# EAGLE design The C64 Big T Switcher FITTEST (EAGLE 9.6.1)
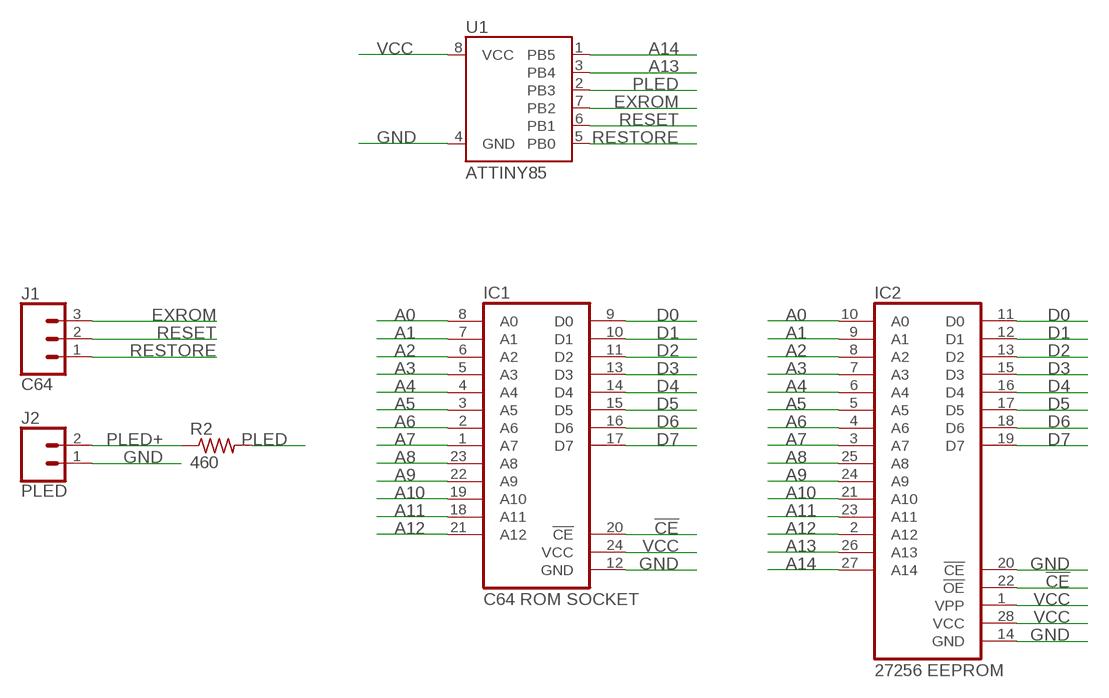
[diagram p0: schematic, sheet 1]

## Parts
IC1  C64 ROM SOCKET  2364  [DIL24]
IC2  27256 EEPROM  27256  [DIL28]
J1  C64  CONN_03  [1X03]
J2  PLED  CONN_02  [1X02]
R2  460  R-US_0207/10  [0207/10]
U1  ATTINY85  [ATTINY85]

## Nets
!CE: IC1.20(!CE) IC2.22(!OE)
A0: IC1.8(A0) IC2.10(A0)
A1: IC1.7(A1) IC2.9(A1)
A2: IC1.6(A2) IC2.8(A2)
A3: IC1.5(A3) IC2.7(A3)
A4: IC1.4(A4) IC2.6(A4)
A5: IC1.3(A5) IC2.5(A5)
A6: IC1.2(A6) IC2.4(A6)
A7: IC1.1(A7) IC2.3(A7)
A8: IC1.23(A8) IC2.25(A8)
A9: IC1.22(A9) IC2.24(A9)
A10: IC1.19(A10) IC2.21(A10)
A11: IC1.18(A11) IC2.23(A11)
A12: IC1.21(A12) IC2.2(A12)
A13: IC2.26(A13) U1.3(PB4)
A14: IC2.27(A14) U1.1(PB5)
D0: IC1.9(D0) IC2.11(D0)
D1: IC1.10(D1) IC2.12(D1)
D2: IC1.11(D2) IC2.13(D2)
D3: IC1.13(D3) IC2.15(D3)
D4: IC1.14(D4) IC2.16(D4)
D5: IC1.15(D5) IC2.17(D5)
D6: IC1.16(D6) IC2.18(D6)
D7: IC1.17(D7) IC2.19(D7)
EXROM: J1.3 U1.7(PB2)
GND: IC1.12(GND) IC2.14(GND) IC2.20(!CE) J2.1 U1.4(GND)
PLED: R2.2 U1.2(PB3)
PLED+: J2.2 R2.1
RESET: J1.2 U1.6(PB1)
RESTORE: J1.1 U1.5(PB0)
VCC: IC1.24(VCC) IC2.1(VPP) IC2.28(VCC) U1.8(VCC)

## Library data of the parts
IC1 = myparts:2364: MEMORY
IC2 = myparts:27256: MEMORY
J1 = SparkFun-Connectors:CONN_03: Multi connection point. Often used as Generic Header-pin footprint for 0.1 inch spaced/style header connections On any of the 0.1 inch spaced packages, you can populate with these: Break Away Headers - Straight <https://www.sparkfun.com/products/116> (PRT-00116) Break Away Male Headers - Right Angle <https://www.sparkfun.com/products/553> (PRT-00553) Female Headers <https://www.sparkfun.com/products/115> (PRT-00115) Break Away Headers - Machine Pin <https://www.sparkfun.com/products/117> (PRT-00117) Break Away Female Headers - Swiss Machine Pin <https://www.sparkfun.com/products/743> (PRT-00743) Stackable Header - 3 Pin (Female, 0.1") <https://www.sparkfun.com/products/13875> (PRT-13875) For SCREWTERMINALS and SPRING TERMINALS visit here: Screw Terimnals on SparkFun.com <https://www.sparkfun.com/search/results?term=Screw+Terminals> (5mm/3.5mm/2.54mm spacing) This device is also useful as a general connection point to wire up your design to another part of your project. Our various solder wires solder well into these plated through hole pads. Hook-Up Wire - Assortment (Stranded, 22 AWG) <https://www.sparkfun.com/products/11375> (PRT-11375) Hook-Up Wire - Assortment (Solid Core, 22 AWG) <https://www.sparkfun.com/products/11367> (PRT-11367) View the entire wire category on our website here <https://www.sparkfun.com/categories/141> Special notes: Molex polarized connector foot print use with SKU : PRT-08232 with associated crimp pins and housings.
J2 = SparkFun-Connectors:CONN_02: Multi connection point. Often used as Generic Header-pin footprint for 0.1 inch spaced/style header connections On any of the 0.1 inch spaced packages, you can populate with these: Break Away Headers - Straight <https://www.sparkfun.com/products/116> (PRT-00116) Break Away Male Headers - Right Angle <https://www.sparkfun.com/products/553> (PRT-00553) Female Headers <https://www.sparkfun.com/products/115> (PRT-00115) Break Away Headers - Machine Pin <https://www.sparkfun.com/products/117> (PRT-00117) Break Away Female Headers - Swiss Machine Pin <https://www.sparkfun.com/products/743> (PRT-00743) For SCREWTERMINALS and SPRING TERMINALS visit here: Screw Terimnals on SparkFun.com <https://www.sparkfun.com/search/results?term=Screw+Terminals> (5mm/3.5mm/2.54mm spacing) This device is also useful as a general connection point to wire up your design to another part of your project. Our various solder wires solder well into these plated through hole pads. Hook-Up Wire - Assortment (Stranded, 22 AWG) <https://www.sparkfun.com/products/11375> (PRT-11375) Hook-Up Wire - Assortment (Solid Core, 22 AWG) <https://www.sparkfun.com/products/11367> (PRT-11367) View the entire wire category on our website here <https://www.sparkfun.com/categories/141> Special notes: Molex polarized connector foot print use with: PRT-08233 with associated crimp pins and housings. 2.54_SCREWTERM for use with PRT-10571. 3.5mm Screw Terminal footprints for PRT-08084 5mm Screw Terminal footprints for use with PRT-08432
R2 = rcl:R-US_: RESISTOR, American symbol; SPICEPREFIX: R
U1 = SparkFun-IC-Microcontroller:ATTINY85; PROD_ID: IC-09092

## Board
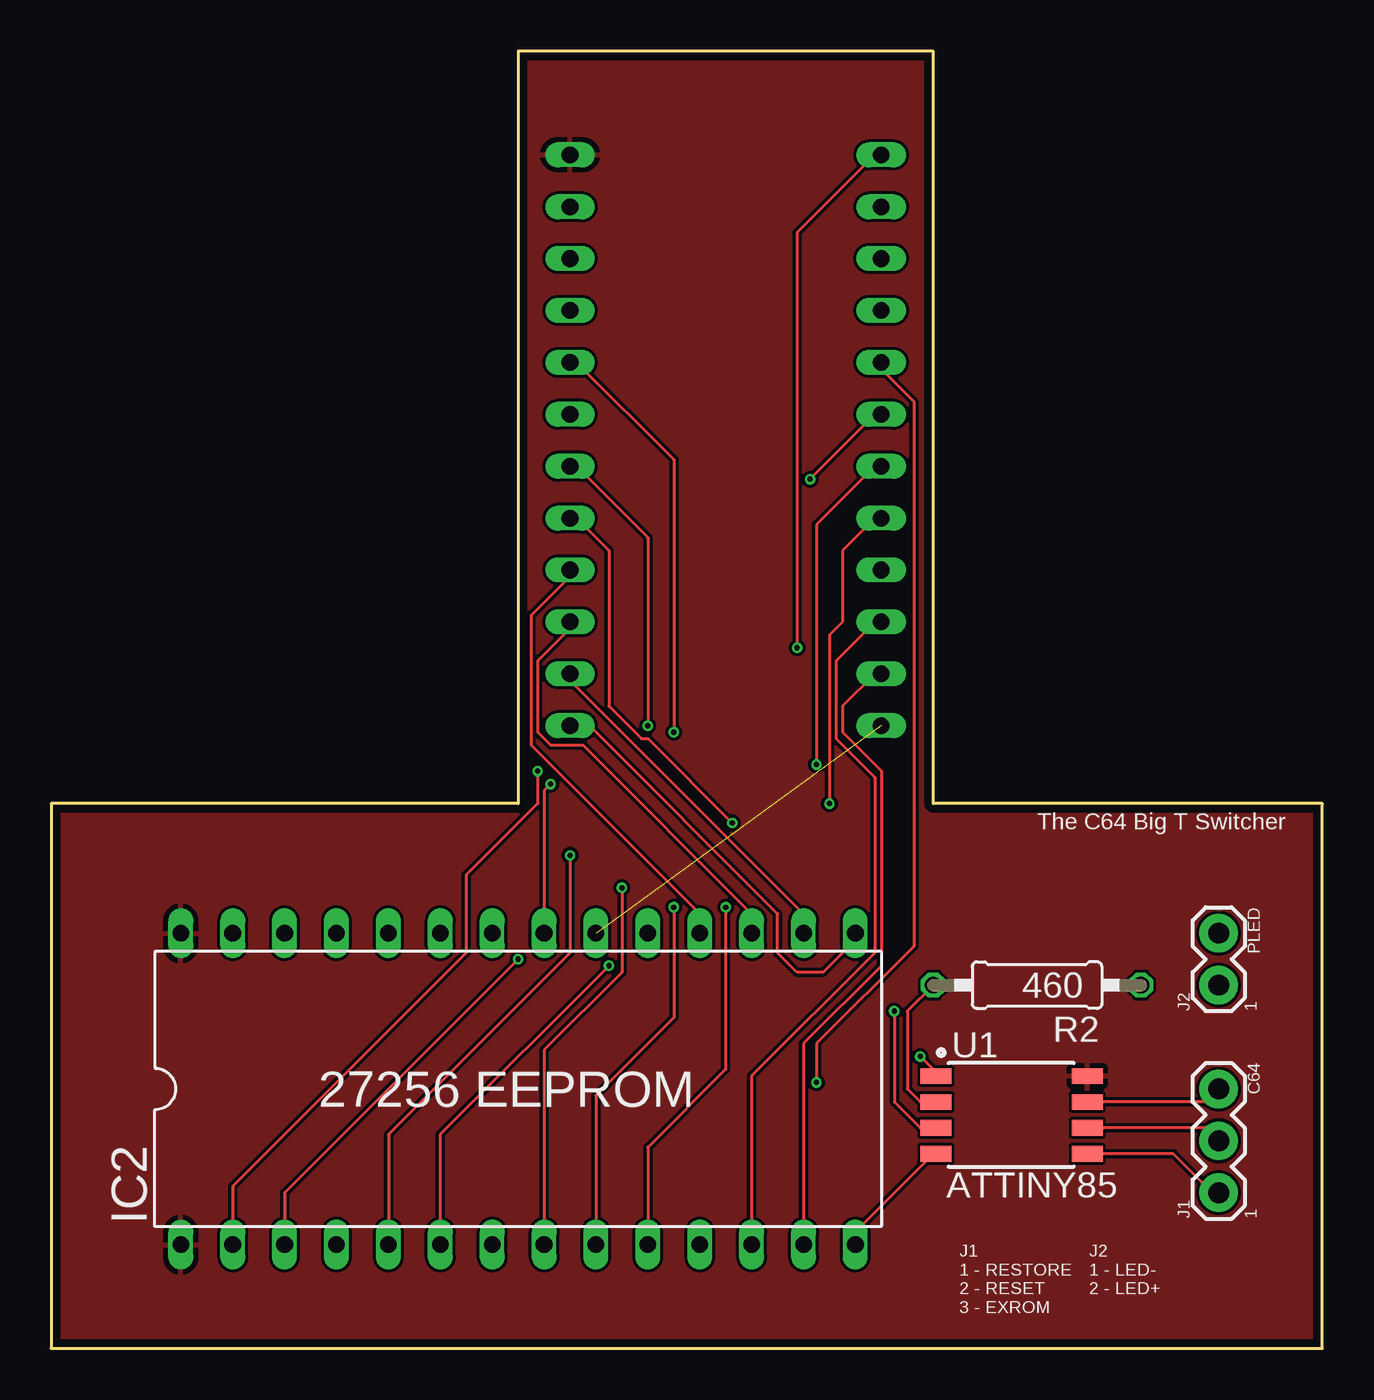
[diagram p1: board, top side]
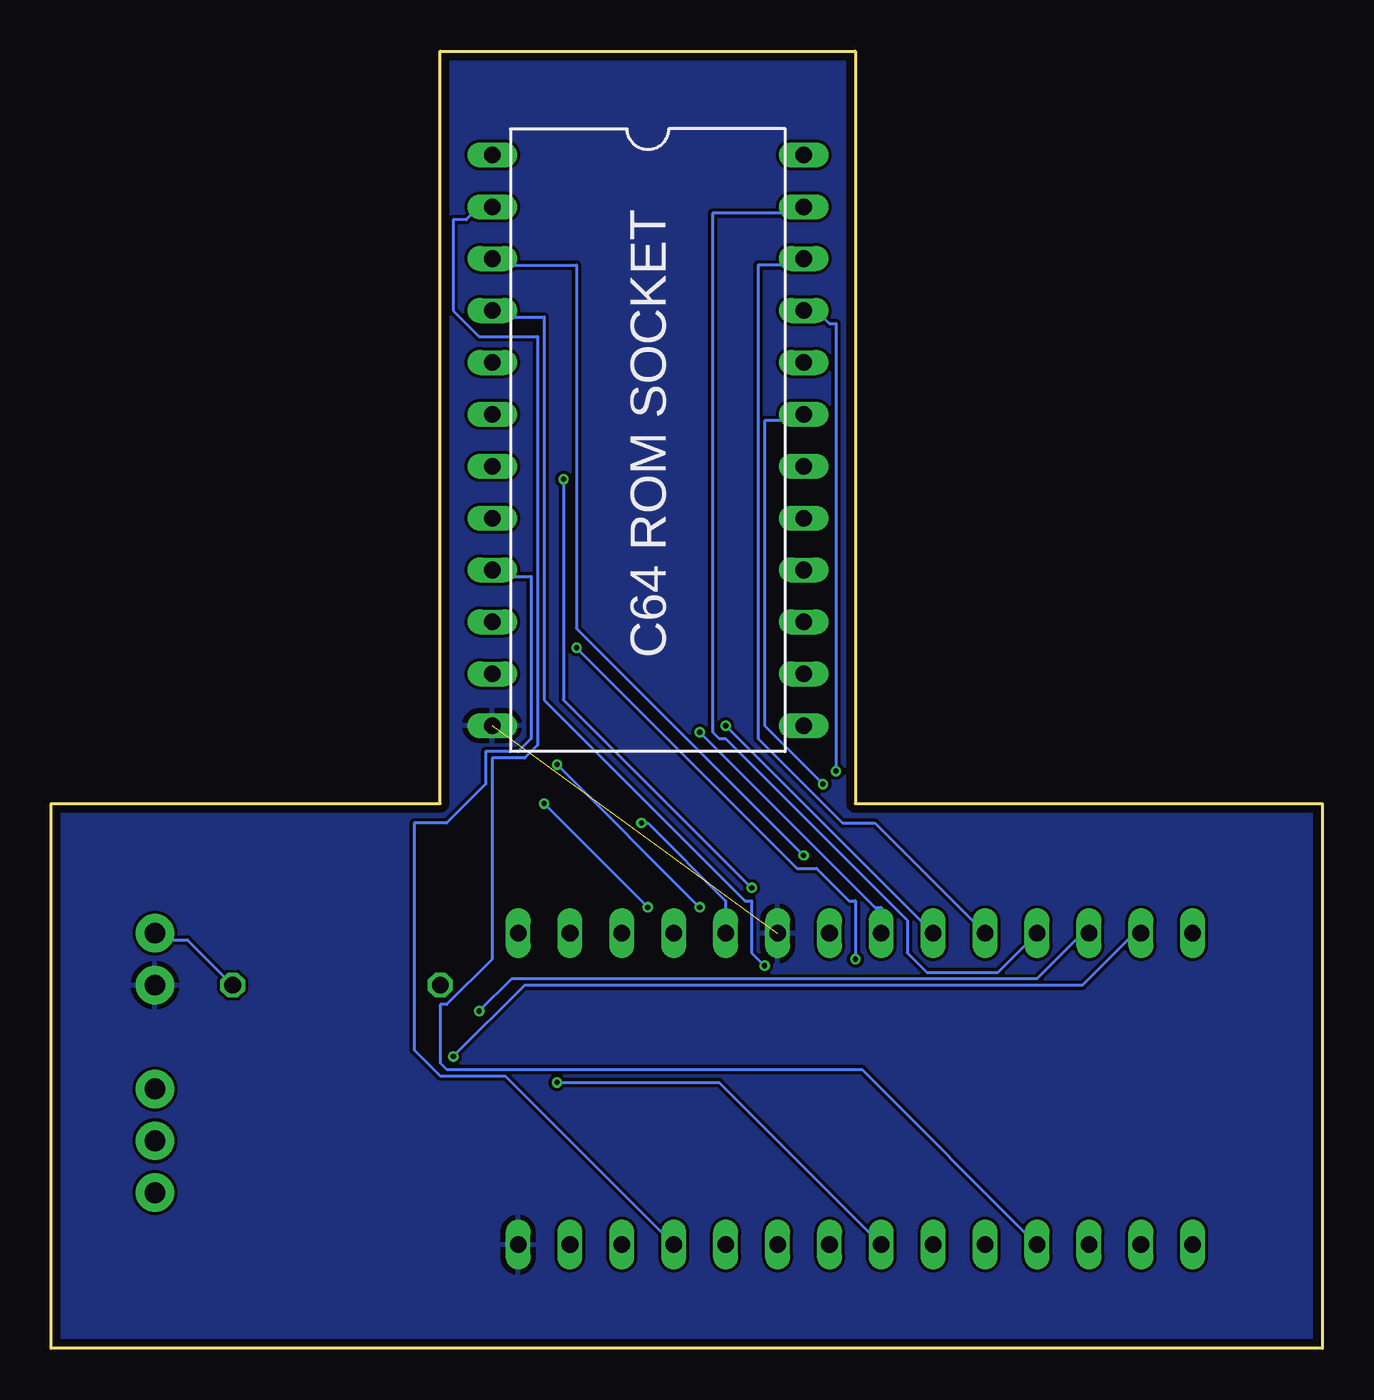
[diagram p2: board, bottom side, seen from below]

Size 62.23 x 63.5 mm. Coordinates in mm from the lower left corner, seen from the top.
Outline: 0,0 62.23,0 62.23,26.67 43.18,26.67 43.18,63.5 22.86,63.5 22.86,26.67 0,26.67 0,0
Copper layers (1*16): Top 0.035559375mm / dielectric 1.6mm / Bottom 0.035559375mm
Design rules "oshpark-2layer": minimum track width 6mil, minimum drill 10mil, track to track 6mil, track to pad 6mil, pad to pad 6mil, via to via 6mil, smd to smd 6mil, copper to edge 15mil, drill to drill 6mil, minimum pad ring 5mil, minimum via ring 5mil, stop-mask expansion 2.5mil, vias tented up to drill 0mil, thermal gap 10mil

### Footprints (pad centres in the part's own frame; a part is rotated, then mirrored left to right if it is on the bottom)
DIL24 = drill 0.813 long: 1 -13.97,-7.62; 2 -11.43,-7.62; 3 -8.89,-7.62; 4 -6.35,-7.62; 5 -3.81,-7.62; 6 -1.27,-7.62; 7 1.27,-7.62; 8 3.81,-7.62; 9 6.35,-7.62; 10 8.89,-7.62; 11 11.43,-7.62; 12 13.97,-7.62; 13 13.97,7.62; 14 11.43,7.62; 15 8.89,7.62; 16 6.35,7.62; 17 3.81,7.62; 18 1.27,7.62; 19 -1.27,7.62; 20 -3.81,7.62; 21 -6.35,7.62; 22 -8.89,7.62; 23 -11.43,7.62; 24 -13.97,7.62
DIL28 = drill 0.813 long: 1 -16.51,-7.62; 2 -13.97,-7.62; 3 -11.43,-7.62; 4 -8.89,-7.62; 5 -6.35,-7.62; 6 -3.81,-7.62; 7 -1.27,-7.62; 8 1.27,-7.62; 9 3.81,-7.62; 10 6.35,-7.62; 11 8.89,-7.62; 12 11.43,-7.62; 13 13.97,-7.62; 14 16.51,-7.62; 15 16.51,7.62; 16 13.97,7.62; 17 11.43,7.62; 18 8.89,7.62; 19 6.35,7.62; 20 3.81,7.62; 21 1.27,7.62; 22 -1.27,7.62; 23 -3.81,7.62; 24 -6.35,7.62; 25 -8.89,7.62; 26 -11.43,7.62; 27 -13.97,7.62; 28 -16.51,7.62
1X03 = drill 1.016 pad 1.88: 1 0,0; 2 2.54,0; 3 5.08,0
1X02 = drill 1.016 pad 1.88: 1 0,0; 2 2.54,0
0207/10 = drill 0.813 octagon: 1 -5.08,0; 2 5.08,0
ATTINY85 = smd 1.524 x 0.762: 1 -3.683,1.905; 2 -3.683,0.635; 3 -3.683,-0.635; 4 -3.683,-1.905; 5 3.727,-1.905; 6 3.727,-0.635; 7 3.727,0.635; 8 3.727,1.905

### Placement (x,y rotation side)
IC1  33.02,44.45 270 bottom
IC2  22.86,12.7 0 top
J1  57.15,7.62 90 top
J2  57.15,17.78 90 top
R2  48.26,17.78 180 top
U1  46.99,11.43 0 top

### Tracks (layer width: path | path; a pad name or v marks a point on that pad's centre or on a via)
!CE  (via drill 0.25)
  Top 0.152: v30.48,30.16 30.48,43.5 25.72,48.26 IC1.20
  Bottom 0.152: IC2.22 21.59,21.59 21.91,21.59 v30.48,30.16
A0  (via drill 0.25)
  Top 0.152: IC2.10 29.21,9.84 33.02,13.65 v33.02,21.59 | v38.1,26.67 38.1,34.92 38.73,35.56 38.73,39.05 40.32,40.64 IC1.8
  Bottom 0.152: v38.1,26.67 v33.02,21.59
A1  (via drill 0.25)
  Top 0.152: IC2.9 26.67,12.38 30.48,16.19 v30.48,21.59 | v37.47,28.57 37.47,40.32 40.32,43.18 IC1.7
  Bottom 0.152: v37.47,28.57 v30.48,21.59
A2  (via drill 0.25)
  Top 0.152: IC2.8 24.13,14.61 27.94,18.41 v27.94,22.54 | v37.15,42.55 40.32,45.72 IC1.6
  Bottom 0.152: v27.94,22.54 37.15,31.75 v37.15,42.55
A3  (via drill 0.25)
  Top 0.152: v37.47,13.02 37.47,14.92 42.23,19.68 42.23,46.35 40.64,47.94 IC1.5
  Bottom 0.152: IC2.7 29.53,13.02 v37.47,13.02
A4  (via drill 0.25)
  Top 0.152: IC2.6 19.05,10.48 v27.3,18.73
  Bottom 0.152: v27.3,18.73 27.94,19.37 27.94,21.91 28.26,21.91 38.1,31.75 38.1,50.48 40.32,50.48 IC1.4
A5  (via drill 0.25)
  Top 0.152: IC2.5 16.51,10.48 25.4,19.37 v25.4,24.13
  Bottom 0.152: v25.4,24.13 36.51,35.24 36.51,53.02 40.32,53.02 IC1.3
A6
  Bottom 0.152: IC2.4 22.54,13.65 42.86,13.65 43.18,13.97 43.18,16.83 42.86,16.83 40.64,19.05 40.64,28.89 39.05,28.89 38.42,29.53 38.42,49.53 41.27,49.53 42.55,50.8 42.55,55.24 41.91,55.24 41.27,55.88 IC1.2
A7  (via drill 0.25)
  Top 0.152: IC2.3 11.43,7.62 v22.86,19.05 | v36.51,34.29 36.51,54.61 40.32,58.42 IC1.1
  Bottom 0.152: v22.86,19.05 22.86,21.91 23.18,21.91 24.77,23.5 25.72,23.5 v36.51,34.29
A8
  Bottom 0.152: IC2.25 15.88,18.41 19.37,18.41 20.32,19.37 20.32,20.95 29.21,29.84 29.53,29.84 29.84,30.16 29.84,55.56 25.72,55.56 IC1.23
A9
  Bottom 0.152: IC2.24 21.91,25.72 23.5,25.72 27.62,29.84 27.62,53.02 25.72,53.02 IC1.22
A10  (via drill 0.25)
  Top 0.152: IC2.21 24.13,27.3 v24.45,27.62
  Bottom 0.152: v24.45,27.62 27.3,30.48 27.3,45.4 25.72,45.4 IC1.19
A11  (via drill 0.25)
  Top 0.152: v29.21,30.48 29.21,39.69 25.72,43.18 IC1.18
  Bottom 0.152: v29.21,30.48 IC2.23
A12  (via drill 0.25)
  Top 0.152: IC2.2 8.89,7.94 20.32,19.37 20.32,23.18 23.81,26.67 v23.81,28.26
  Bottom 0.152: v23.81,28.26 23.81,50.16 24.13,50.16 24.77,50.8 IC1.21
A13  (via drill 0.25)
  Top 0.152: U1.3 42.55,10.79 41.27,12.06 v41.27,16.51
  Bottom 0.152: v41.27,16.51 39.69,18.1 13.97,18.1 11.75,20.32 IC2.26
A14  (via drill 0.25)
  Top 0.152: v42.55,14.29 43.18,13.65 43.18,13.34 U1.1
  Bottom 0.152: v42.55,14.29 39.05,17.78 11.75,17.78 9.21,20.32 IC2.27
D0
  Bottom 0.152: IC2.11 40.01,13.34 43.18,13.34 44.45,14.61 44.45,25.72 42.86,25.72 40.96,27.62 40.96,29.21 39.37,29.21 38.73,29.84 38.73,37.78 40.32,37.78 IC1.9
D1
  Top 0.152: IC2.12 34.29,13.34 40.32,19.37 40.32,27.94 38.42,29.84 38.42,33.66 40.32,35.56 IC1.10
D2
  Top 0.152: IC2.13 36.83,14.92 40.64,18.73 40.64,28.26 38.73,30.16 38.73,31.43 40.32,33.02 IC1.11
D3
  Top 0.152: IC1.13 26.35,30.48 35.56,21.27 35.56,19.37 36.51,18.41 37.78,18.41 39.37,20 IC2.15
D4
  Top 0.152: IC2.16 36.83,21.27 25.4,32.7 IC1.14
D5
  Top 0.152: IC2.17 34.29,21.27 26.04,29.53 24.45,29.53 23.81,30.16 23.81,33.66 25.4,35.24 IC1.15
D6
  Top 0.152: IC2.18 31.75,21.27 23.5,29.53 23.5,35.88 25.4,37.78 IC1.16
D7  (via drill 0.25)
  Top 0.152: v33.34,25.72 29.21,29.84 28.89,29.84 27.3,31.43 27.3,39.05 25.72,40.64 IC1.17
  Bottom 0.152: IC2.19 29.21,21.91 33.02,25.72 v33.34,25.72
EXROM
  Top 0.152: U1.7 56.52,12.06 J1.3
GND  (1 unrouted)
  Top 0.152: IC2.14 39.37,5.71 43.18,9.53 U1.4
  pour Bottom: 0,0 62.23,0 62.23,26.67 43.18,26.67 43.18,63.5 22.86,63.5 22.86,26.67 0,26.67
PLED
  Top 0.152: U1.2 42.55,12.06 41.91,12.7 41.91,16.51 R2.2
PLED+
  Bottom 0.152: R2.1 55.56,20 56.83,20 J2.2
RESET
  Top 0.152: U1.6 56.52,10.79 J1.2
RESTORE
  Top 0.152: U1.5 54.93,9.53 56.83,7.62 J1.1
VCC
  pour Top: 0,0 62.23,0 62.23,26.67 43.18,26.67 43.18,63.5 22.86,63.5 22.86,26.67 0,26.67

### Text on the board
tPlace: The C64 Big T Switcher | 1 | 1 | J1 / 1 - RESTORE / 2 - RESET / 3 - EXROM | J2 / 1 - LED- / 2 - LED+